# EAGLE design linemixer2 (EAGLE 7.4.0)
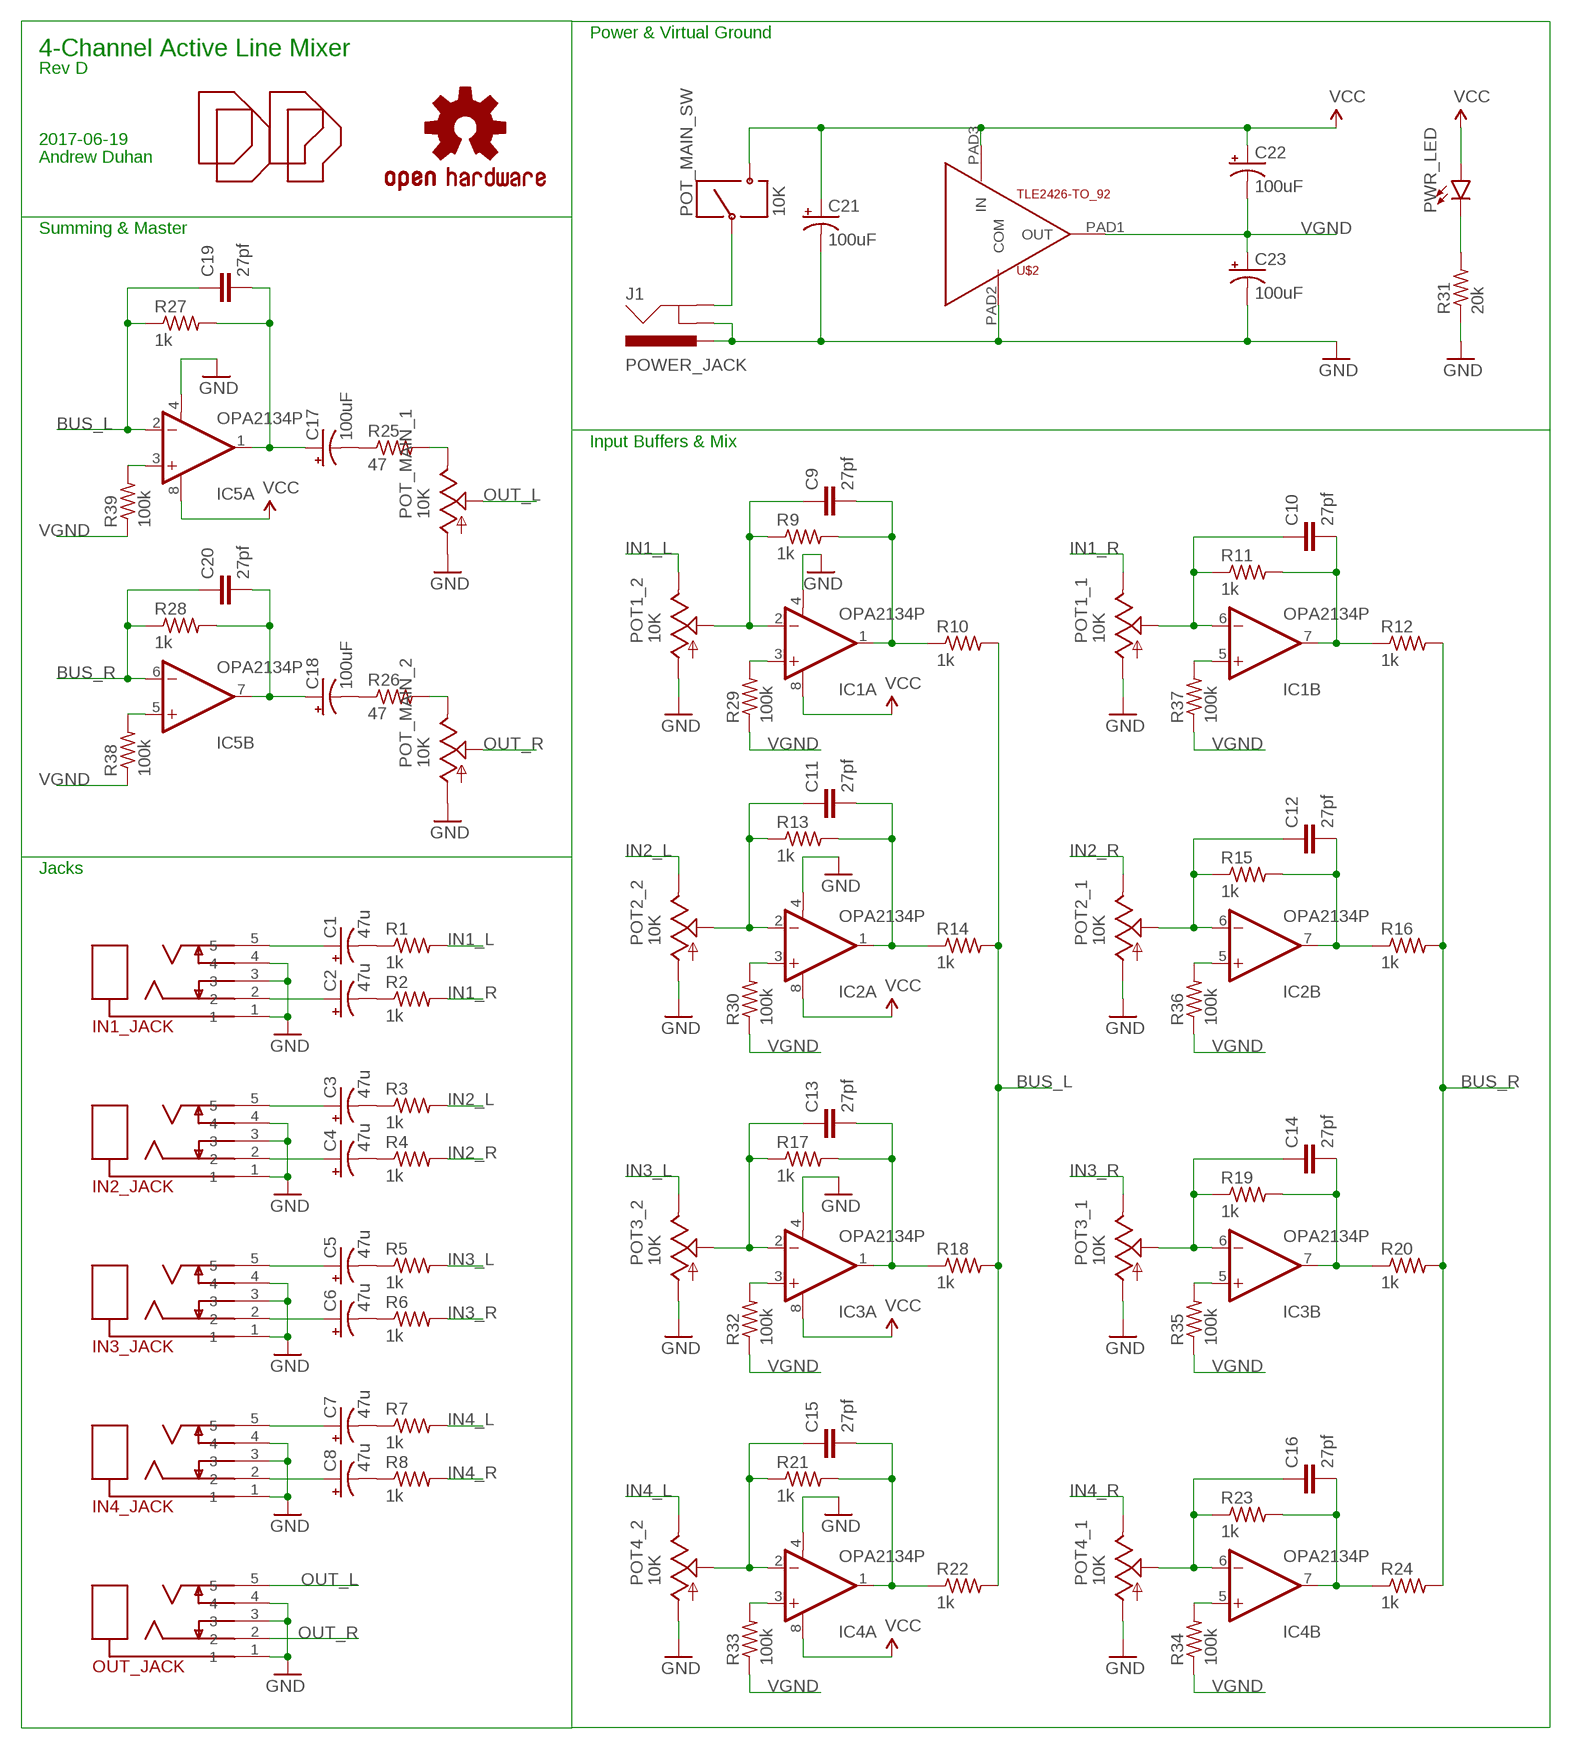
[diagram p0: schematic, sheet 1]

## Parts
C1  47u  100UF-POLAR-RADIAL-2.5MM-25V-20%  [CPOL-RADIAL-2.5MM-6.5MM]
C2  47u  100UF-POLAR-RADIAL-2.5MM-25V-20%  [CPOL-RADIAL-2.5MM-6.5MM]
C3  47u  100UF-POLAR-RADIAL-2.5MM-25V-20%  [CPOL-RADIAL-2.5MM-6.5MM]
C4  47u  100UF-POLAR-RADIAL-2.5MM-25V-20%  [CPOL-RADIAL-2.5MM-6.5MM]
C5  47u  100UF-POLAR-RADIAL-2.5MM-25V-20%  [CPOL-RADIAL-2.5MM-6.5MM]
C6  47u  100UF-POLAR-RADIAL-2.5MM-25V-20%  [CPOL-RADIAL-2.5MM-6.5MM]
C7  47u  100UF-POLAR-RADIAL-2.5MM-25V-20%  [CPOL-RADIAL-2.5MM-6.5MM]
C8  47u  100UF-POLAR-RADIAL-2.5MM-25V-20%  [CPOL-RADIAL-2.5MM-6.5MM]
C9  27pf  CAPPTH  [CAP-PTH-SMALL]
C10  27pf  CAPPTH  [CAP-PTH-SMALL]
C11  27pf  CAPPTH  [CAP-PTH-SMALL]
C12  27pf  CAPPTH  [CAP-PTH-SMALL]
C13  27pf  CAPPTH  [CAP-PTH-SMALL]
C14  27pf  CAPPTH  [CAP-PTH-SMALL]
C15  27pf  CAPPTH  [CAP-PTH-SMALL]
C16  27pf  CAPPTH  [CAP-PTH-SMALL]
C17  100uF  100UF-POLAR-RADIAL-2.5MM-25V-20%  [CPOL-RADIAL-2.5MM-6.5MM]
C18  100uF  100UF-POLAR-RADIAL-2.5MM-25V-20%  [CPOL-RADIAL-2.5MM-6.5MM]
C19  27pf  CAPPTH  [CAP-PTH-SMALL]
C20  27pf  CAPPTH  [CAP-PTH-SMALL]
C21  100uF  100UF-POLAR-RADIAL-2.5MM-25V-20%  [CPOL-RADIAL-2.5MM-6.5MM]
C22  100uF  100UF-POLAR-RADIAL-2.5MM-25V-20%  [CPOL-RADIAL-2.5MM-6.5MM]
C23  100uF  100UF-POLAR-RADIAL-2.5MM-25V-20%  [CPOL-RADIAL-2.5MM-6.5MM]
IC1  OPA2134P  [DIL08]
IC2  OPA2134P  [DIL08]
IC3  OPA2134P  [DIL08]
IC4  OPA2134P  [DIL08]
IC5  OPA2134P  [DIL08]
IN1_JACK  JACK_STEREO_SWCUI-SJ1-351X  [AUDIO_JACK-CUI-SJ1-351X]
IN2_JACK  JACK_STEREO_SWCUI-SJ1-351X  [AUDIO_JACK-CUI-SJ1-351X]
IN3_JACK  JACK_STEREO_SWCUI-SJ1-351X  [AUDIO_JACK-CUI-SJ1-351X]
IN4_JACK  JACK_STEREO_SWCUI-SJ1-351X  [AUDIO_JACK-CUI-SJ1-351X]
J1  POWER_JACK  [POWER_JACK_PTH]
LOGO1  OSHW-LOGOS  [OSHW-LOGO-S]
OUT_JACK  JACK_STEREO_SWCUI-SJ1-351X  [AUDIO_JACK-CUI-SJ1-351X]
POT1_  10K  POT_BOURNS_PTD902  [BOURNS_PTD902]
POT2_  10K  POT_BOURNS_PTD902  [BOURNS_PTD902]
POT3_  10K  POT_BOURNS_PTD902  [BOURNS_PTD902]
POT4_  10K  POT_BOURNS_PTD902  [BOURNS_PTD902]
POT_MAIN_  10K  POT_BOURNS_PTR902  [BOURNS_PTR902]
PWR_LED  LED3MM  [LED_3MM]
R1  1k  R-US_0204/5  [0204/5]
R2  1k  R-US_0204/5  [0204/5]
R3  1k  R-US_0204/5  [0204/5]
R4  1k  R-US_0204/5  [0204/5]
R5  1k  R-US_0204/5  [0204/5]
R6  1k  R-US_0204/5  [0204/5]
R7  1k  R-US_0204/5  [0204/5]
R8  1k  R-US_0204/5  [0204/5]
R9  1k  R-US_0204/5  [0204/5]
R10  1k  R-US_0204/5  [0204/5]
R11  1k  R-US_0204/5  [0204/5]
R12  1k  R-US_0204/5  [0204/5]
R13  1k  R-US_0204/5  [0204/5]
R14  1k  R-US_0204/5  [0204/5]
R15  1k  R-US_0204/5  [0204/5]
R16  1k  R-US_0204/5  [0204/5]
R17  1k  R-US_0204/5  [0204/5]
R18  1k  R-US_0204/5  [0204/5]
R19  1k  R-US_0204/5  [0204/5]
R20  1k  R-US_0204/5  [0204/5]
R21  1k  R-US_0204/5  [0204/5]
R22  1k  R-US_0204/5  [0204/5]
R23  1k  R-US_0204/5  [0204/5]
R24  1k  R-US_0204/5  [0204/5]
R25  47  R-US_0204/5  [0204/5]
R26  47  R-US_0204/5  [0204/5]
R27  1k  R-US_0204/5  [0204/5]
R28  1k  R-US_0204/5  [0204/5]
R29  100k  R-US_0204/5  [0204/5]
R30  100k  R-US_0204/5  [0204/5]
R31  20k  R-US_0204/5  [0204/5]
R32  100k  R-US_0204/5  [0204/5]
R33  100k  R-US_0204/5  [0204/5]
R34  100k  R-US_0204/5  [0204/5]
R35  100k  R-US_0204/5  [0204/5]
R36  100k  R-US_0204/5  [0204/5]
R37  100k  R-US_0204/5  [0204/5]
R38  100k  R-US_0204/5  [0204/5]
R39  100k  R-US_0204/5  [0204/5]
U$1  DP_LOGO  [DP_LOGO]
U$2  TLE2426-TO_92  [TO-92]
U$3  DP_LOGO  [DP_LOGO]

## Nets
BUS_L: C19.1 IC5.2(A:-IN) R10.2 R14.2 R18.2 R22.2 R27.1
BUS_R: C20.1 IC5.6(B:-IN) R12.2 R16.2 R20.2 R24.2 R28.1
GND: C21.2(-) C23.2(-) IC1.4(A:V-) IC2.4(A:V-) IC3.4(A:V-) IC4.4(A:V-) IC5.4(A:V-) IN1_JACK.1 IN1_JACK.3 IN1_JACK.4 IN2_JACK.1 IN2_JACK.3 IN2_JACK.4 IN3_JACK.1 IN3_JACK.3 IN3_JACK.4 IN4_JACK.1 IN4_JACK.3 IN4_JACK.4 J1.GNDBREAK J1.PWR OUT_JACK.1 OUT_JACK.3 OUT_JACK.4 POT1_.R1-A(1:A) POT1_.R2-A(2:A) POT2_.R1-A(1:A) POT2_.R2-A(2:A) POT3_.R1-A(1:A) POT3_.R2-A(2:A) POT4_.R1-A(1:A) POT4_.R2-A(2:A) POT_MAIN_.R1-A(1:A) POT_MAIN_.R2-A(2:A) R31.1 U$2.PAD2(COM)
IN1_L: POT1_.R2-B(2:B) R1.2
IN1_R: POT1_.R1-B(1:B) R2.2
IN2_L: POT2_.R2-B(2:B) R3.2
IN2_R: POT2_.R1-B(1:B) R4.2
IN3_L: POT3_.R2-B(2:B) R5.2
IN3_R: POT3_.R1-B(1:B) R6.2
IN4_L: POT4_.R2-B(2:B) R7.2
IN4_R: POT4_.R1-B(1:B) R8.2
N$1: C1.1(+) IN1_JACK.5
N$2: C2.1(+) IN1_JACK.2
N$3: C3.1(+) IN2_JACK.5
N$4: C4.1(+) IN2_JACK.2
N$5: C5.1(+) IN3_JACK.5
N$6: C6.1(+) IN3_JACK.2
N$7: C7.1(+) IN4_JACK.5
N$8: C8.1(+) IN4_JACK.2
N$9: C1.2(-) R1.1
N$10: C2.2(-) R2.1
N$11: C3.2(-) R3.1
N$12: C4.2(-) R4.1
N$13: C5.2(-) R5.1
N$14: C6.2(-) R6.1
N$15: C7.2(-) R7.1
N$16: C8.2(-) R8.1
N$17: C9.2 IC1.1(A:OUT) R9.2 R10.1
N$18: C11.2 IC2.1(A:OUT) R13.2 R14.1
N$19: IC1.3(A:+IN) R29.2
N$20: IC5.3(A:+IN) R39.2
N$21: C10.2 IC1.7(B:OUT) R11.2 R12.1
N$22: C17.1(+) C19.2 IC5.1(A:OUT) R27.2
N$23: C18.1(+) C20.2 IC5.7(B:OUT) R28.2
N$24: IC5.5(B:+IN) R38.2
N$25: C12.2 IC2.7(B:OUT) R15.2 R16.1
N$27: C13.2 IC3.1(A:OUT) R17.2 R18.1
N$29: C14.2 IC3.7(B:OUT) R19.2 R20.1
N$30: IC2.3(A:+IN) R30.2
N$31: C15.2 IC4.1(A:OUT) R21.2 R22.1
N$33: C16.2 IC4.7(B:OUT) R23.2 R24.1
N$34: IC3.3(A:+IN) R32.2
N$35: C17.2(-) R25.1
N$36: C18.2(-) R26.1
N$37: POT_MAIN_.R1-B(1:B) R25.2
N$38: POT_MAIN_.R2-B(2:B) R26.2
N$40: C9.1 IC1.2(A:-IN) POT1_.R2-W(2:W) R9.1
N$41: PWR_LED.K(C) R31.2
N$42: J1.GND POT_MAIN_.P$2
N$44: IC4.3(A:+IN) R33.2
N$46: IC4.5(B:+IN) R34.2
N$48: IC3.5(B:+IN) R35.2
N$50: C13.1 IC3.2(A:-IN) POT3_.R2-W(2:W) R17.1
N$51: C11.1 IC2.2(A:-IN) POT2_.R2-W(2:W) R13.1
N$52: C15.1 IC4.2(A:-IN) POT4_.R2-W(2:W) R21.1
N$53: IC2.5(B:+IN) R36.2
N$55: IC1.5(B:+IN) R37.2
N$60: C10.1 IC1.6(B:-IN) POT1_.R1-W(1:W) R11.1
N$61: C12.1 IC2.6(B:-IN) POT2_.R1-W(1:W) R15.1
N$62: C14.1 IC3.6(B:-IN) POT3_.R1-W(1:W) R19.1
N$64: C16.1 IC4.6(B:-IN) POT4_.R1-W(1:W) R23.1
OUT_L: OUT_JACK.5 POT_MAIN_.R1-W(1:W)
OUT_R: OUT_JACK.2 POT_MAIN_.R2-W(2:W)
VCC: C21.1(+) C22.1(+) IC1.8(A:V+) IC2.8(A:V+) IC3.8(A:V+) IC4.8(A:V+) IC5.8(A:V+) POT_MAIN_.P$1 PWR_LED.A U$2.PAD3(IN)
VGND: C22.2(-) C23.1(+) R29.1 R30.1 R32.1 R33.1 R34.1 R35.1 R36.1 R37.1 R38.1 R39.1 U$2.PAD1(OUT)

## Notes on the sheet
- Power & Virtual Ground
- 4-Channel Active Line Mixer
- Rev D
- 2017-06-19
- Andrew Duhan
- Summing & Master
- Input Buffers & Mix
- Jacks

## Library data of the parts
C1-C8 = SparkFun-Capacitors:100UF-POLAR: 100µF polarized capacitors A capacitor is a passive two-terminal electrical component used to store electrical energy temporarily in an electric field.; PROD_ID: CAP-08439; VALUE: 100uF
C9-C16 C19 C20 = SparkFun-Capacitors:CAP: Capacitor Standard 0603 ceramic capacitor, and 0.1" leaded capacitor.
C17 C18 C21-C23 = SparkFun-Capacitors:100UF-POLAR: 100µF polarized capacitors A capacitor is a passive two-terminal electrical component used to store electrical energy temporarily in an electric field.; PROD_ID: CAP-08439
IC1-IC5 = burr-brown:OPA2134: Operational Amplifier; MF: TEXAS INSTRUMENTS; MPN: OPA2134PA; OC_FARNELL: 1097574; OC_NEWARK: 74K3897
IN1_JACK IN2_JACK IN3_JACK IN4_JACK OUT_JACK = myparts:JACK_STEREO_SW
J1 = SparkFun-Connectors:POWER_JACK: Power Jack Connector This is the standard 5.5mm barrel jack for power. The PTH is the most common, proven, reliable, footprint. The Slot footprint only works if the mill layer is transmitted to the PCB fab house so be warned. Here are the connectors we sell at SparkFun: DC Barrel Power Jack/Connector <https://www.sparkfun.com/products/119> (PRT-00119) DC Barrel Power Jack/Connector (SMD) <https://www.sparkfun.com/products/12748> (PRT-12748) DC Barrel Jack Adapter - Breadboard Compatible <https://www.sparkfun.com/products/10811> (PRT-10811) It is used on this SparkFun product (and many, many others): SparkFun RedBoard - Programmed with Arduino <https://www.sparkfun.com/products/12757> (DEV-12757) Also, if you need a mating power supply or connector, please check these out: Wall Adapter Power Supply - 9VDC 650mA <https://www.sparkfun.com/products/298> (TOL-00298) DC Barrel Jack Adapter - Male <https://www.sparkfun.com/products/10287> (PRT-10287); PROD_ID: CONN-08197
LOGO1 = SparkFun-Aesthetics:OSHW-LOGO: Open-Source Hardware (OSHW) Logo This logo indicates the piece of hardware it is found on incorporates a OSHW license and/or adheres to the definition of open source hardware found here: http://freedomdefined.org/OSHW
POT1_ POT2_ POT3_ POT4_ = myparts:POT_BOURNS_PTD902
POT_MAIN_ = myparts:POT_BOURNS_PTR902
PWR_LED = SparkFun-LED:LED: LED (Generic) Standard schematic elements and footprints for 5mm, 3mm, 1206, and 0603 sized LEDs. Generic LEDs with no color specified.; PROD_ID: DIO-08794
R1-R39 = adafruit:R-US_: RESISTOR, American symbol
U$1 U$3 = myparts:DP_LOGO: Duhan Power! logo
U$2 = myparts:TLE2426-TO_92

## Board
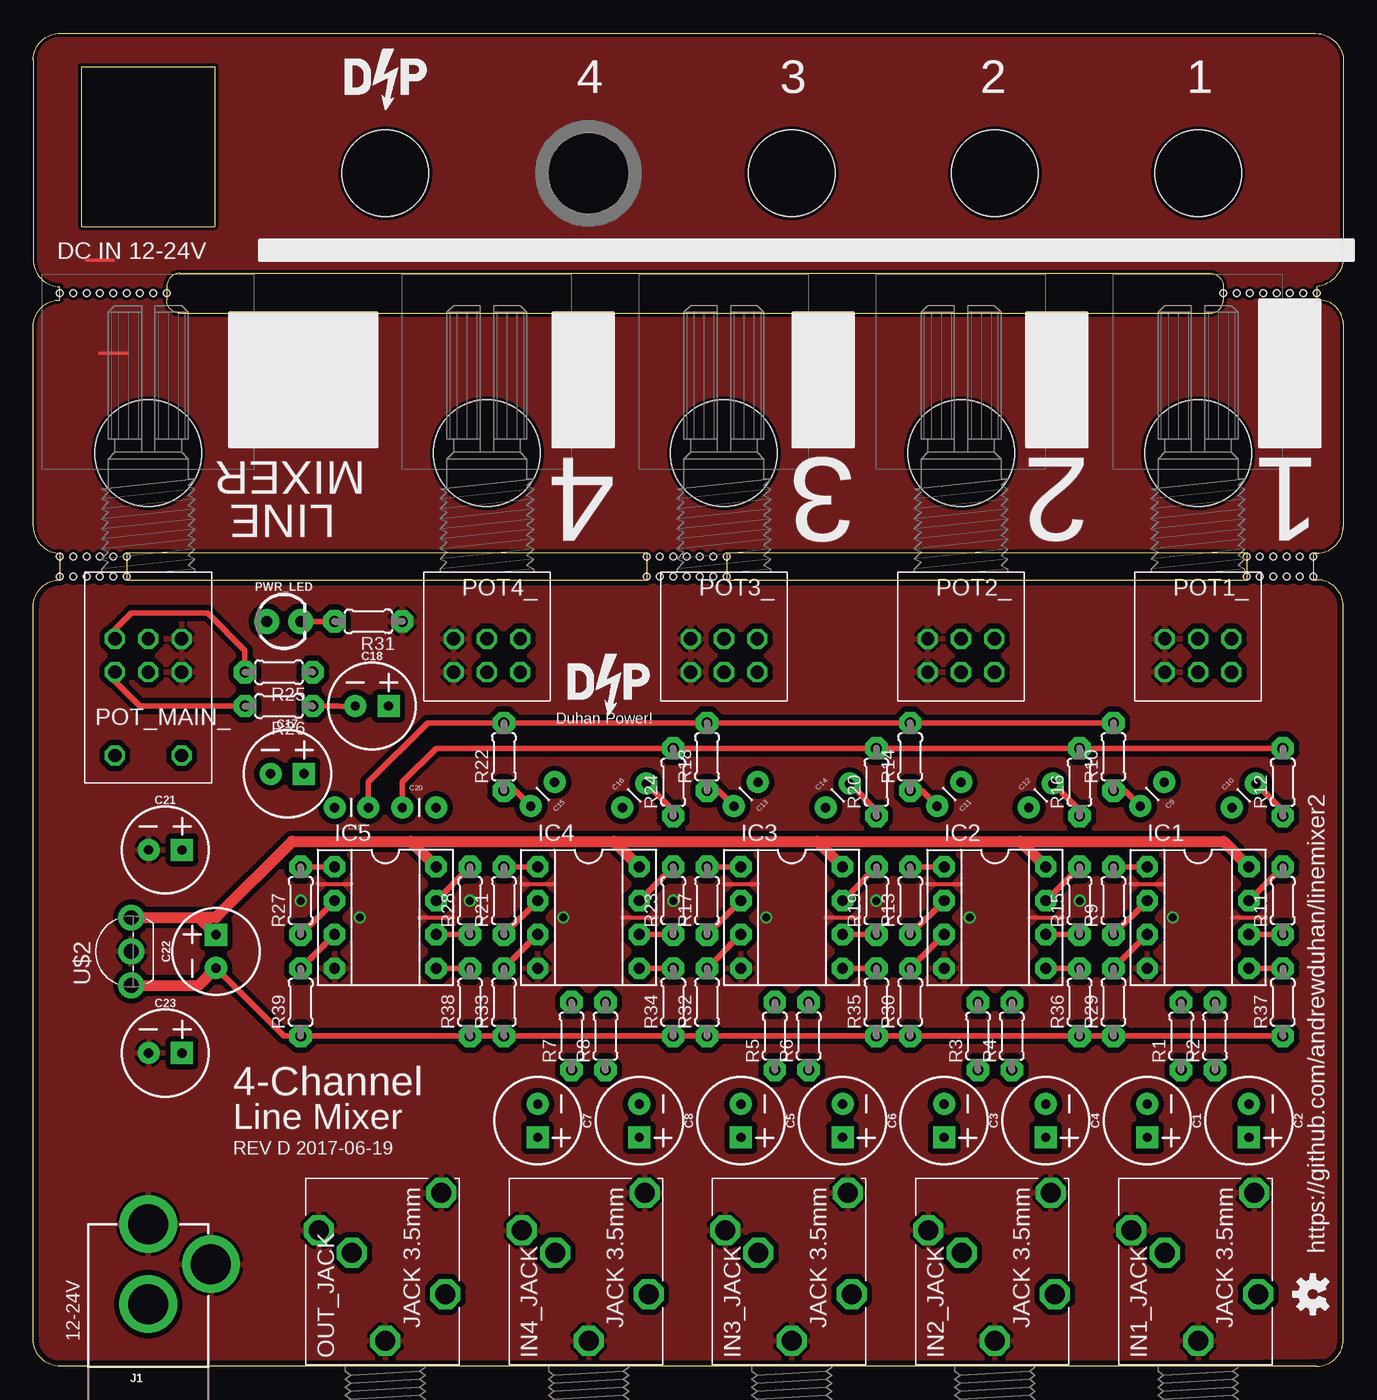
[diagram p1: board, top side]
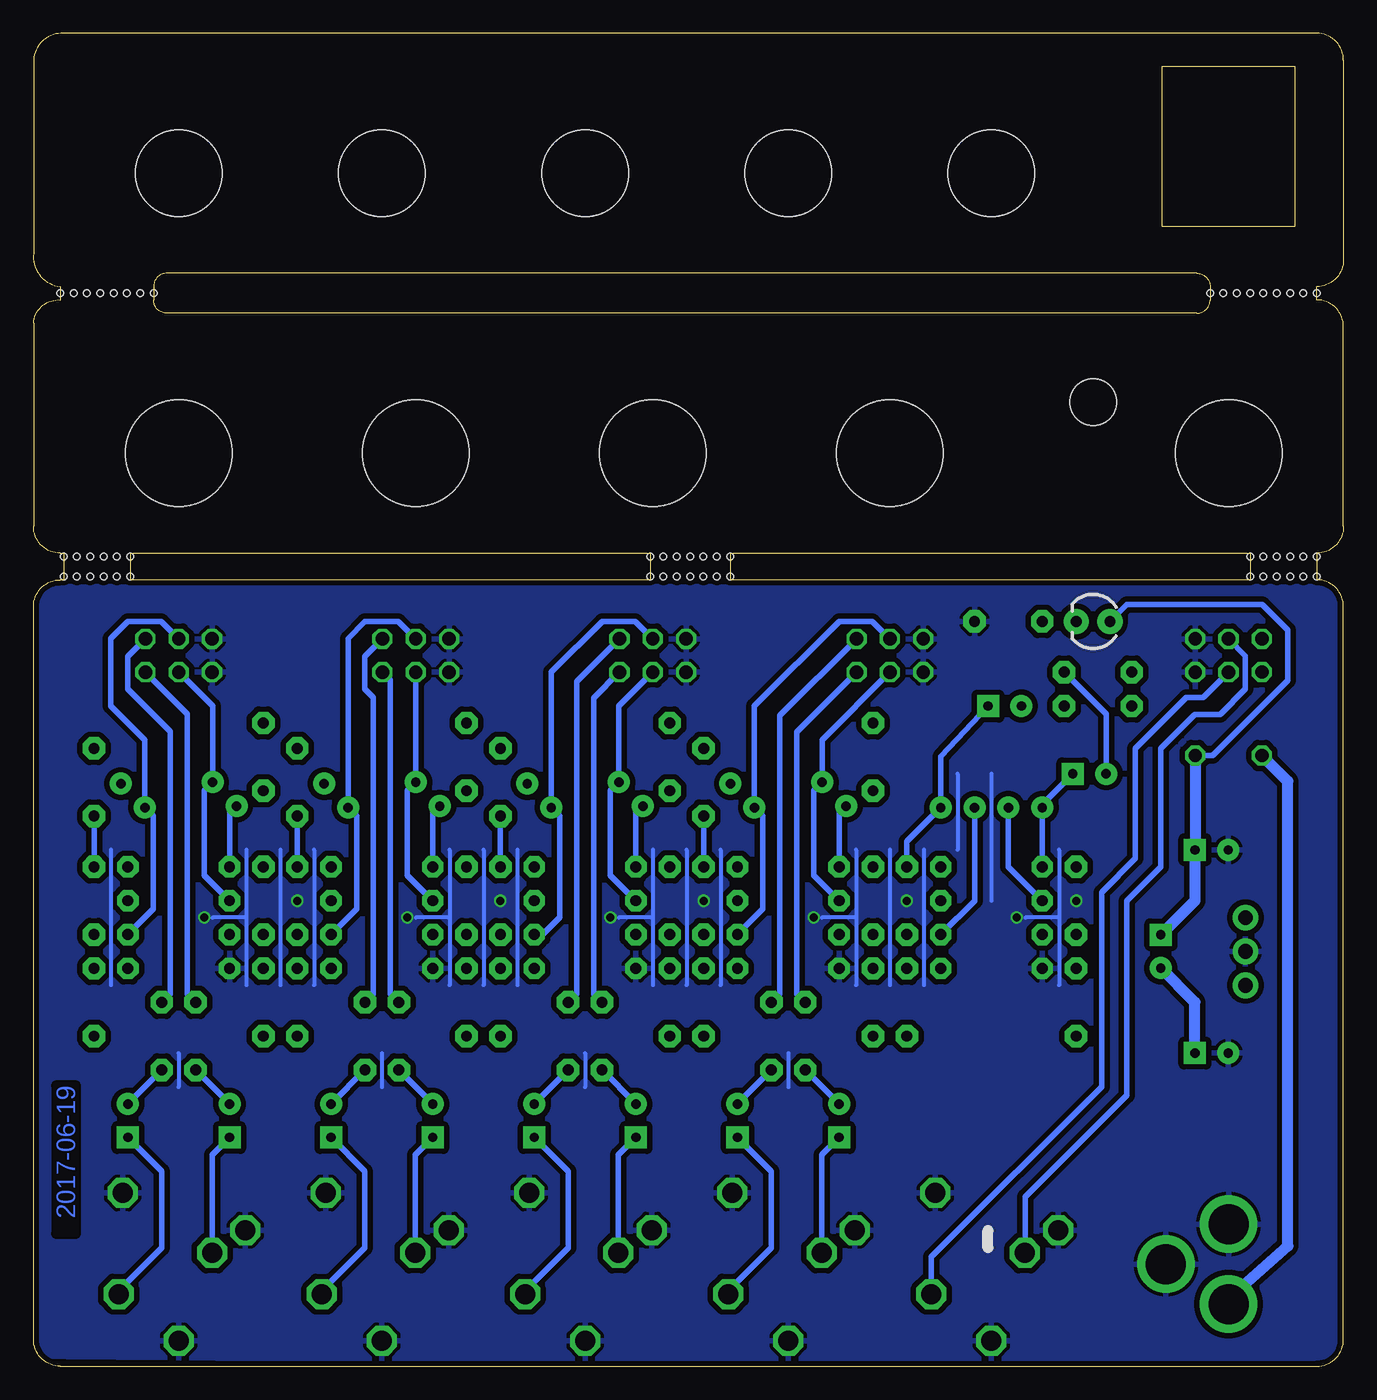
[diagram p2: board, bottom side, seen from below]

Size 98.26 x 100 mm. Coordinates in mm from the lower left corner, seen from the top.
Outline: 7,59 46,59 46,61 7,61 7,59
Outline: 52,59 91,59 91,61 52,61 52,59
Outline: 96,59 96.25,59 arc-90 98.25,57 98.25,2 arc-90 96.25,0 2,0 arc-90 0,2 0,57 arc-90 2,59 2,61 arc-90 0,63 0,78 arc-90 2,80 2,81 arc-90 0,83 0,98 arc-90 2,100 96,100 arc-90 98.25,98 98.25,83.5 arc-90 96.25,81 96.25,80 arc-90 98.25,78.25 98.25,63 arc-90 96.25,61 96,61 96,59
Outline: 3.62,97.5 13.62,97.5 13.62,85.5 3.62,85.5 3.62,97.5
Outline: 11,82 88.25,82 arc-90 89.25,81 89.25,80 arc-90 88.25,79 11,79 arc-90 10,80 10,81 arc-90 11,82
Copper layers (1*16): Top 0.035mm / dielectric 1.5mm / Bottom 0.035mm
Design rules "dirt_cheap_dirty_boards.v1": minimum track width 5mil, minimum drill 12mil, track to track 5mil, track to pad 5mil, pad to pad 5mil, via to via 5mil, smd to smd 0mil, copper to edge 10mil, drill to drill 10mil, minimum pad ring 10mil, minimum via ring 6mil, stop-mask expansion 2mil, vias tented up to drill 25mil, thermal gap 10mil
Holes 6.5 mm at 26.4,89.5 41.64,89.5 56.88,89.5 72.12,89.5 87.36,89.5
Holes 8 mm at 8.62,68.5 34.02,68.5 51.8,68.5 69.58,68.5 87.36,68.5
Holes 3.5 mm at 18.78,72.31
Holes 0.5 mm at 2,80.5 4,80.5 5,80.5 6,80.5 7,80.5 8,80.5 9,80.5 10,80.5 3,80.5 95.25,80.5 94.25,80.5 89.25,80.5 90.25,80.5 91.25,80.5 92.25,80.5 93.25,80.5 96.25,80.5 2,60.75 2,59.25 3,59.25 4,59.25 5,59.25 6,59.25 7,59.25 3,60.75 4,60.75 5,60.75 6,60.75 7,60.75 96,60.75 96,59.25 95,59.25 94,59.25 93,59.25 92,59.25 91,59.25 95,60.75 94,60.75 93,60.75 92,60.75 91,60.75 49,60.75 48,60.75 47,60.75 46,60.75 50,60.75 51,60.75 52,60.75 49,59.25 48,59.25 47,59.25 46,59.25 50,59.25 51,59.25 52,59.25

### Footprints (pad centres in the part's own frame; a part is rotated, then mirrored left to right if it is on the bottom)
CPOL-RADIAL-2.5MM-6.5MM = drill 0.7 pad 1.651 square: 1 1.25,0 | drill 0.7 pad 1.651: 2 -1.25,0
CAP-PTH-SMALL = drill 0.7 pad 1.651: 1 0,0; 2 2.54,0
DIL08 = drill 0.813 pad 1.6 octagon: 1 -3.81,-3.81; 2 -1.27,-3.81; 3 1.27,-3.81; 4 3.81,-3.81; 5 3.81,3.81; 6 1.27,3.81; 7 -1.27,3.81; 8 -3.81,3.81
AUDIO_JACK-CUI-SJ1-351X = drill 1.5 octagon: 1 0,0; 2 3.5,-4.5; 3 8.3,5; 4 11.1,-4.2; 5 6.6,2.5
POWER_JACK_PTH = drill 2.997 pad 4.318: GND 0,7.7; GNDBREAK 4.7,10.7; PWR 0,13.7
BOURNS_PTD902 = drill 1 octagon: R1-A 2.5,2.5; R1-B 2.5,-2.5; R1-W 2.5,0; R2-A 0,2.5; R2-B 0,-2.5; R2-W 0,0
BOURNS_PTR902 = drill 1 octagon: P$1 -6.25,-2.5; P$2 -6.25,2.5; R1-A 2.5,-2.5; R1-B 2.5,2.5; R1-W 2.5,0; R2-A 0,-2.5; R2-B 0.01,2.5; R2-W 0,0
LED_3MM = drill 0.813 pad 1.88: A -1.27,0; K 1.27,0
0204/5 = drill 0.813 pad 1.676 octagon: 1 -2.54,0; 2 2.54,0
TO-92 = drill 1.1 pad 1.93: PAD1 -2.54,0; PAD2 0,0; PAD3 2.54,0

### Placement (x,y rotation side)
C1  83.55,18.41 270 top
C2  91.17,18.41 270 top
C3  68.31,18.41 270 top
C4  75.93,18.41 270 top
C5  53.07,18.41 270 top
C6  60.69,18.41 270 top
C7  37.83,18.41 270 top
C8  45.45,18.41 270 top
C9  84.82,43.81 225 top
C10  89.9,41.91 45 top
C11  69.58,43.81 225 top
C12  74.66,41.91 45 top
C13  54.34,43.81 225 top
C14  59.42,41.91 45 top
C15  39.1,43.81 225 top
C16  44.18,41.91 45 top
C17  19.05,44.45 0 top
C18  25.4,49.53 0 top
C19  25.13,41.91 180 top
C20  27.67,41.91 0 top
C21  9.89,38.73 0 top
C22  13.7,31.11 90 top
C23  9.89,23.5 0 top
IC1  87.36,33.66 270 top
IC2  72.12,33.66 270 top
IC3  56.88,33.66 270 top
IC4  41.64,33.66 270 top
IC5  26.4,33.66 270 top
IN1_JACK  87.36,1.91 90 top
IN2_JACK  72.12,1.91 90 top
IN3_JACK  56.88,1.91 90 top
IN4_JACK  41.64,1.91 90 top
J1  8.62,-3.04 0 top
LOGO1  95.97,5.4 90 top
OUT_JACK  26.4,1.91 90 top
POT1_  87.36,52.07 90 top
POT2_  69.58,52.07 90 top
POT3_  51.8,52.07 90 top
POT4_  34.02,52.07 90 top
POT_MAIN_  8.62,52.07 90 top
PWR_LED  18.78,55.88 0 top
R1  86.09,24.77 90 top
R2  88.63,24.77 90 top
R3  70.85,24.77 90 top
R4  73.39,24.77 90 top
R5  55.61,24.77 90 top
R6  58.15,24.77 90 top
R7  40.37,24.77 90 top
R8  42.91,24.77 90 top
R9  81.01,34.92 90 top
R10  81.01,45.72 90 top
R11  93.71,34.92 90 top
R12  93.71,43.81 90 top
R13  65.77,34.92 90 top
R14  65.77,45.72 90 top
R15  78.47,34.92 90 top
R16  78.47,43.81 90 top
R17  50.53,34.92 90 top
R18  50.53,45.72 90 top
R19  63.23,34.92 90 top
R20  63.23,43.81 90 top
R21  35.29,34.92 90 top
R22  35.29,45.72 90 top
R23  47.99,34.92 90 top
R24  47.99,43.81 90 top
R25  18.41,52.07 180 top
R26  18.41,49.53 180 top
R27  20.05,34.92 90 top
R28  32.75,34.92 90 top
R29  81.01,27.3 90 top
R30  65.77,27.3 90 top
R31  25.13,55.88 180 top
R32  50.53,27.3 90 top
R33  35.29,27.3 90 top
R34  47.99,27.3 90 top
R35  63.23,27.3 90 top
R36  78.47,27.3 90 top
R37  93.71,27.3 90 top
R38  32.75,27.3 90 top
R39  20.05,27.3 90 top
U$1  42.98,51.36 0 top
U$2  7.35,31.11 90 top
U$3  26.25,96.75 0 top

### Tracks (layer width: path | path; a pad name or v marks a point on that pad's centre or on a via)
BUS_L
  Top 0.406: R27.1 IC5.2 | R10.2 R14.2 R18.2 R22.2 29.57,48.26 25.13,43.81 C19.1
  Bottom 0.406: IC5.2 25.13,37.47 C19.1
BUS_R
  Top 0.406: IC5.6 R28.1 | R12.2 R16.2 R20.2 R24.2 30.21,46.35 27.67,43.81 C20.1
  Bottom 0.406: IC5.6 27.67,34.92 C20.1
G3
  Top 0.254: 5,76 7,76
  pour Top: -1,80 99,80 99,60 -1,60
G4
  Top 0.254: 4,83 6,83
  pour Top: -1,101 -1,81 99,81 99,101
GND  (via drill 0.6)
  Top 0.305: 21.32,36.2 23.86,36.2 | 28.94,33.66 31.48,33.66 | 36.56,36.2 39.1,36.2 | 44.18,33.66 46.72,33.66 | 51.8,36.2 54.34,36.2 | 59.42,33.66 61.96,33.66 | 67.04,36.2 69.58,36.2 | 74.66,33.66 77.2,33.66 | 82.28,36.2 84.82,36.2 | 89.9,33.66 92.44,33.66
  Bottom 0.305: 46.72,38.73 46.72,28.57 | 28.94,44.45 28.94,38.73 | 61.96,38.73 61.96,28.57 | 77.2,38.73 77.2,28.57 | 92.44,38.73 92.44,28.57 | 79.74,38.73 79.74,28.57 | 64.5,38.73 64.5,28.57 | 49.26,38.73 49.26,28.57 | 26.4,44.45 26.4,34.92 | 41.64,23.5 41.64,20.95 | 56.88,23.5 56.88,20.95 | 72.12,23.5 72.12,20.95 | 87.36,23.5 87.36,20.95 | 82.28,38.73 82.28,33.66 | 82.28,33.66 82.28,28.57 | 51.8,38.73 51.8,33.66 | 51.8,33.66 51.8,28.57 | 67.04,38.73 67.04,33.66 | 67.04,33.66 67.04,28.57 | 36.56,38.73 36.56,33.66 | 36.56,33.66 36.56,28.57 | 34.02,38.73 34.02,28.57 | 31.48,38.73 31.48,28.57 | 21.32,38.73 21.32,33.66 | 21.32,33.66 21.32,28.57 | 21.32,33.66 23.86,33.66 | 36.56,33.66 39.1,33.66 | 51.8,33.66 54.34,33.66 | 67.04,33.66 69.58,33.66 | 82.28,33.66 84.82,33.66
  other vias: 39.73,33.66 54.98,33.66 70.22,33.66 85.45,33.66 78.47,34.92 63.23,34.92 47.99,34.92 32.75,34.92 24.5,33.66 20.05,34.92
  pour Bottom (isolate 0.406, rank 3): -1.27,60.96 99.52,61.96 99.52,0.73 -1.19,-0.27 -1.19,-0.08
  pour Top (isolate 0.406, rank 3): -1.27,59.96 99.52,59.96 99.52,0.73 -1.19,-0.27
IN1_L
  Bottom 0.406: POT1_.R2-B 86.72,48.94 86.72,27.94 R1.2
IN1_R
  Bottom 0.406: POT1_.R1-B 91.17,53.26 91.17,50.8 88,47.62 88,27.94 R2.2
IN2_L
  Bottom 0.406: POT2_.R2-B 71.48,51.48 71.48,27.94 R3.2
IN2_R
  Bottom 0.406: POT2_.R1-B 73.39,53.26 73.39,50.8 72.75,50.16 72.75,27.94 R4.2
IN3_L
  Bottom 0.406: POT3_.R2-B 56.24,50.12 56.24,27.94 R5.2
IN3_R
  Bottom 0.406: POT3_.R1-B 57.52,51.35 57.52,27.94 R6.2
IN4_L
  Bottom 0.406: POT4_.R2-B 41.01,47.59 41.01,27.94 R7.2
IN4_R
  Bottom 0.406: POT4_.R1-B 42.27,48.81 42.27,27.94 R8.2
N$1
  Bottom 0.406: IN1_JACK.5 84.86,15.86 C1.1
N$2
  Bottom 0.406: IN1_JACK.2 91.86,5.66 88.63,8.89 88.63,14.62 C2.1
N$3
  Bottom 0.406: IN2_JACK.5 69.62,15.86 C3.1
N$4
  Bottom 0.406: IN2_JACK.2 76.62,5.66 73.39,8.89 73.39,14.62 C4.1
N$5
  Bottom 0.406: IN3_JACK.5 54.38,15.86 C5.1
N$6
  Bottom 0.406: IN3_JACK.2 61.38,5.66 58.15,8.89 58.15,14.62 C6.1
N$7
  Bottom 0.406: IN4_JACK.5 39.14,15.86 C7.1
N$8
  Bottom 0.406: IN4_JACK.2 46.14,5.66 42.91,8.89 42.91,14.62 C8.1
N$9
  Bottom 0.406: C1.2 83.55,19.68 R1.1
N$10
  Bottom 0.406: C2.2 91.17,19.68 R2.1
N$11
  Bottom 0.406: C3.2 68.31,19.68 R3.1
N$12
  Bottom 0.406: C4.2 75.93,19.68 R4.1
N$13
  Bottom 0.406: C5.2 53.07,19.68 R5.1
N$14
  Bottom 0.406: C6.2 60.69,19.68 R6.1
N$15
  Bottom 0.406: C7.2 37.83,19.68 R7.1
N$16
  Bottom 0.406: C8.2 45.45,19.68 R8.1
N$17
  Top 0.406: R10.1 81.86,43.18 C9.2 | R9.2 IC1.1
  Bottom 0.406: IC1.1 83.55,41.49 C9.2
N$18
  Top 0.406: R13.2 IC2.1 | R14.1 66.62,43.18 C11.2
  Bottom 0.406: IC2.1 68.31,41.49 C11.2
N$19
  Top 0.406: R29.2 IC1.3
N$20
  Top 0.406: R39.2 IC5.3
N$21
  Top 0.406: IC1.7 R11.2 | R12.1 93.71,41.69 C10.2
  Bottom 0.406: R12.1 R11.2
N$22
  Top 0.406: R27.2 IC5.1
  Bottom 0.406: IC5.1 C19.2 22.59,42.16 C17.1
N$23
  Top 0.406: R28.2 IC5.7
  Bottom 0.406: C18.1 30.21,45.74 C20.2 32.75,39.37 R28.2
N$24
  Top 0.406: IC5.5 R38.2
N$25
  Top 0.406: IC2.7 R15.2 | R16.1 78.47,41.69 C12.2
  Bottom 0.406: R16.1 R15.2
N$27
  Top 0.406: R18.1 51.38,43.18 C13.2 | R17.2 IC3.1
  Bottom 0.406: IC3.1 53.07,41.49 C13.2
N$29
  Top 0.406: IC3.7 R19.2 | R20.1 63.23,41.69 C14.2
  Bottom 0.406: R20.1 R19.2
N$30
  Top 0.406: R30.2 IC2.3
N$31
  Top 0.406: R22.1 36.14,43.18 C15.2 | R21.2 IC4.1
  Bottom 0.406: IC4.1 37.83,41.49 C15.2
N$33
  Top 0.406: IC4.7 R23.2 | R24.1 47.99,41.69 C16.2
  Bottom 0.406: R24.1 R23.2
N$34
  Top 0.406: R32.2 IC3.3
N$35
  Bottom 0.406: C17.2 17.8,48.91 R25.1
N$36
  Top 0.406: C18.2 23.2,49.51 22.86,49.53 R26.1
N$37
  Top 0.406: POT_MAIN_.R1-B 6.08,54.61 6.08,55.24 7.35,56.52 13.06,56.52 15.88,53.7 R25.2
N$38
  Top 0.406: POT_MAIN_.R2-B 6.08,52.04 6.08,51.44 7.99,49.53 R26.2
N$40
  Top 0.406: IC1.2 R9.1
  Bottom 0.406: POT1_.R2-W 84.82,49.53 C9.1 85.45,43.18 85.45,36.83 IC1.2
N$41
  Top 0.406: R31.2 PWR_LED.K
N$42
  Bottom 0.813: POT_MAIN_.P$2 4.17,43.88 4.17,9.03 8.54,5.16 J1.GND
N$44
  Top 0.406: R33.2 IC4.3
N$46
  Top 0.406: IC4.5 R34.2
N$48
  Top 0.406: IC3.5 R35.2
N$50
  Top 0.406: R17.1 IC3.2
  Bottom 0.406: IC3.2 54.98,36.83 54.98,43.18 C13.1 54.34,49.53 POT3_.R2-W
N$51
  Top 0.406: R13.1 IC2.2
  Bottom 0.406: IC2.2 70.22,36.83 70.22,43.18 C11.1 POT2_.R2-W
N$52
  Top 0.406: R21.1 IC4.2
  Bottom 0.406: IC4.2 39.73,36.83 39.73,43.18 C15.1 39.1,46.99 POT4_.R2-W
N$53
  Top 0.406: IC2.5 R36.2
N$55
  Top 0.406: R37.2 IC1.5
N$60
  Top 0.406: IC1.6 R11.1
  Bottom 0.406: IC1.6 89.27,34.29 89.27,41.27 C10.1 89.9,46.99 92.44,49.53 92.44,54.61 91.17,55.88 88.67,55.88 POT1_.R1-W
N$61
  Top 0.406: IC2.6 R15.1
  Bottom 0.406: IC2.6 74.03,34.29 74.03,41.27 C12.1 74.66,54.61 73.39,55.88 70.89,55.88 POT2_.R1-W
N$62
  Top 0.406: IC3.6 R19.1
  Bottom 0.406: IC3.6 60.05,32.38 58.78,33.66 58.78,41.27 C14.1 59.42,52.07 55.61,55.88 53.11,55.88 POT3_.R1-W
N$64
  Top 0.406: IC4.6 R23.1
  Bottom 0.406: IC4.6 43.55,34.29 43.55,41.27 C16.1 44.18,49.53 37.83,55.88 35.33,55.88 POT4_.R1-W
OUT_L
  Bottom 0.406: OUT_JACK.5 23.86,8.54 23.86,12.7 16.24,20.32 16.24,34.92 13.7,37.47 13.7,46.35 11.16,48.9 9.26,48.9 7.35,50.8 7.35,53.3 POT_MAIN_.R1-W
OUT_R
  Bottom 0.406: OUT_JACK.2 30.9,8.2 18.14,20.95 18.14,35.56 15.61,38.1 15.61,46.35 11.79,50.16 10.53,50.16 POT_MAIN_.R2-W
VCC
  Top 0.813: 28.3,39.37 19.41,39.37 13.7,33.66 12.41,33.66 | 28.3,39.37 43.55,39.37 | 43.55,39.37 58.78,39.37 | 58.78,39.37 74.03,39.37 | 74.03,39.37 89.27,39.37 IC1.8 | IC2.8 74.03,39.37 | IC3.8 58.78,39.37 | IC4.8 43.55,39.37 | IC5.8 28.3,39.37 | U$2.PAD3 12.41,33.66 | 12.41,33.66 C22.1
  Bottom 0.406: PWR_LED.A 16.24,57.15 6.08,57.15 4.17,55.24 4.17,51.44 9.79,45.82 POT_MAIN_.P$1
  Bottom 0.813: POT_MAIN_.P$1 11.12,38.76 C21.1 11.14,34.92 C22.1
VGND
  Top 0.406: R37.1 R29.1 R36.1 R30.1 R35.1 R32.1 R34.1 R33.1 R38.1 R39.1 18.8,24.77 C22.2
  Top 0.813: U$2.PAD1 12.41,28.57 C22.2
  Bottom 0.813: C23.1 11.14,27.3 C22.2

### Text on the board
Bottom: 2017-06-19
tPlace: 4 | 3 | 2 | 1 | DC IN 12-24V | MIXER | 4 | 3 | 2 | 1 | LINE | Duhan Power! | 4-Channel | Line Mixer | REV D 2017-06-19 | https://github.com/andrewduhan/linemixer2 | 12-24V